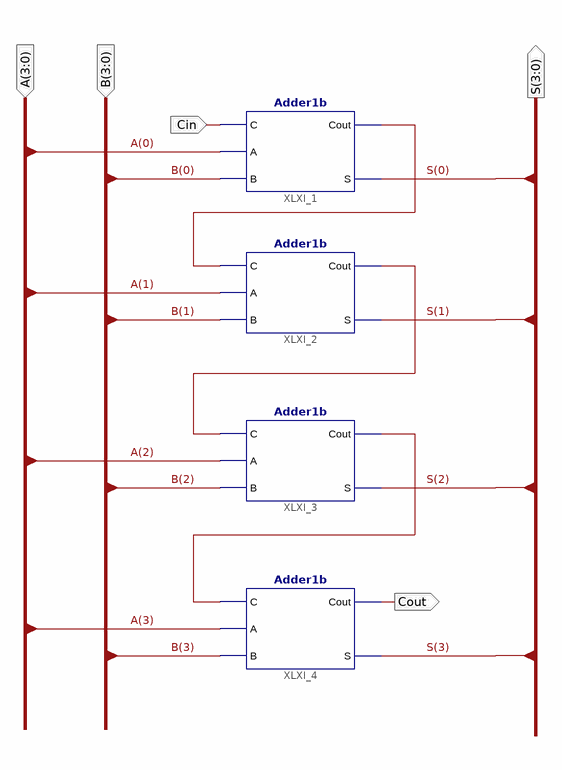
[diagram p0: schematic sheet 1]
// Xilinx ISE schematic Adder4b.sch (artix7) as structural Verilog: 4 symbols, 5 ports
module Adder4b (
  input  Cin,
  input  [3:0] A,
  input  [3:0] B,
  output [3:0] S,
  output Cout
);

  wire XLXN_1, XLXN_2, XLXN_3;

  Adder1b XLXI_1 (.C(Cin), .A(A[0]), .B(B[0]), .Cout(XLXN_1), .S(S[0]));
  Adder1b XLXI_2 (.C(XLXN_1), .A(A[1]), .B(B[1]), .Cout(XLXN_2), .S(S[1]));
  Adder1b XLXI_3 (.C(XLXN_2), .A(A[2]), .B(B[2]), .Cout(XLXN_3), .S(S[2]));
  Adder1b XLXI_4 (.C(XLXN_3), .A(A[3]), .B(B[3]), .Cout(Cout), .S(S[3]));
endmodule
